# EAGLE design ALog-Shield (EAGLE 9.0.1)

## Sheet 1 of 2
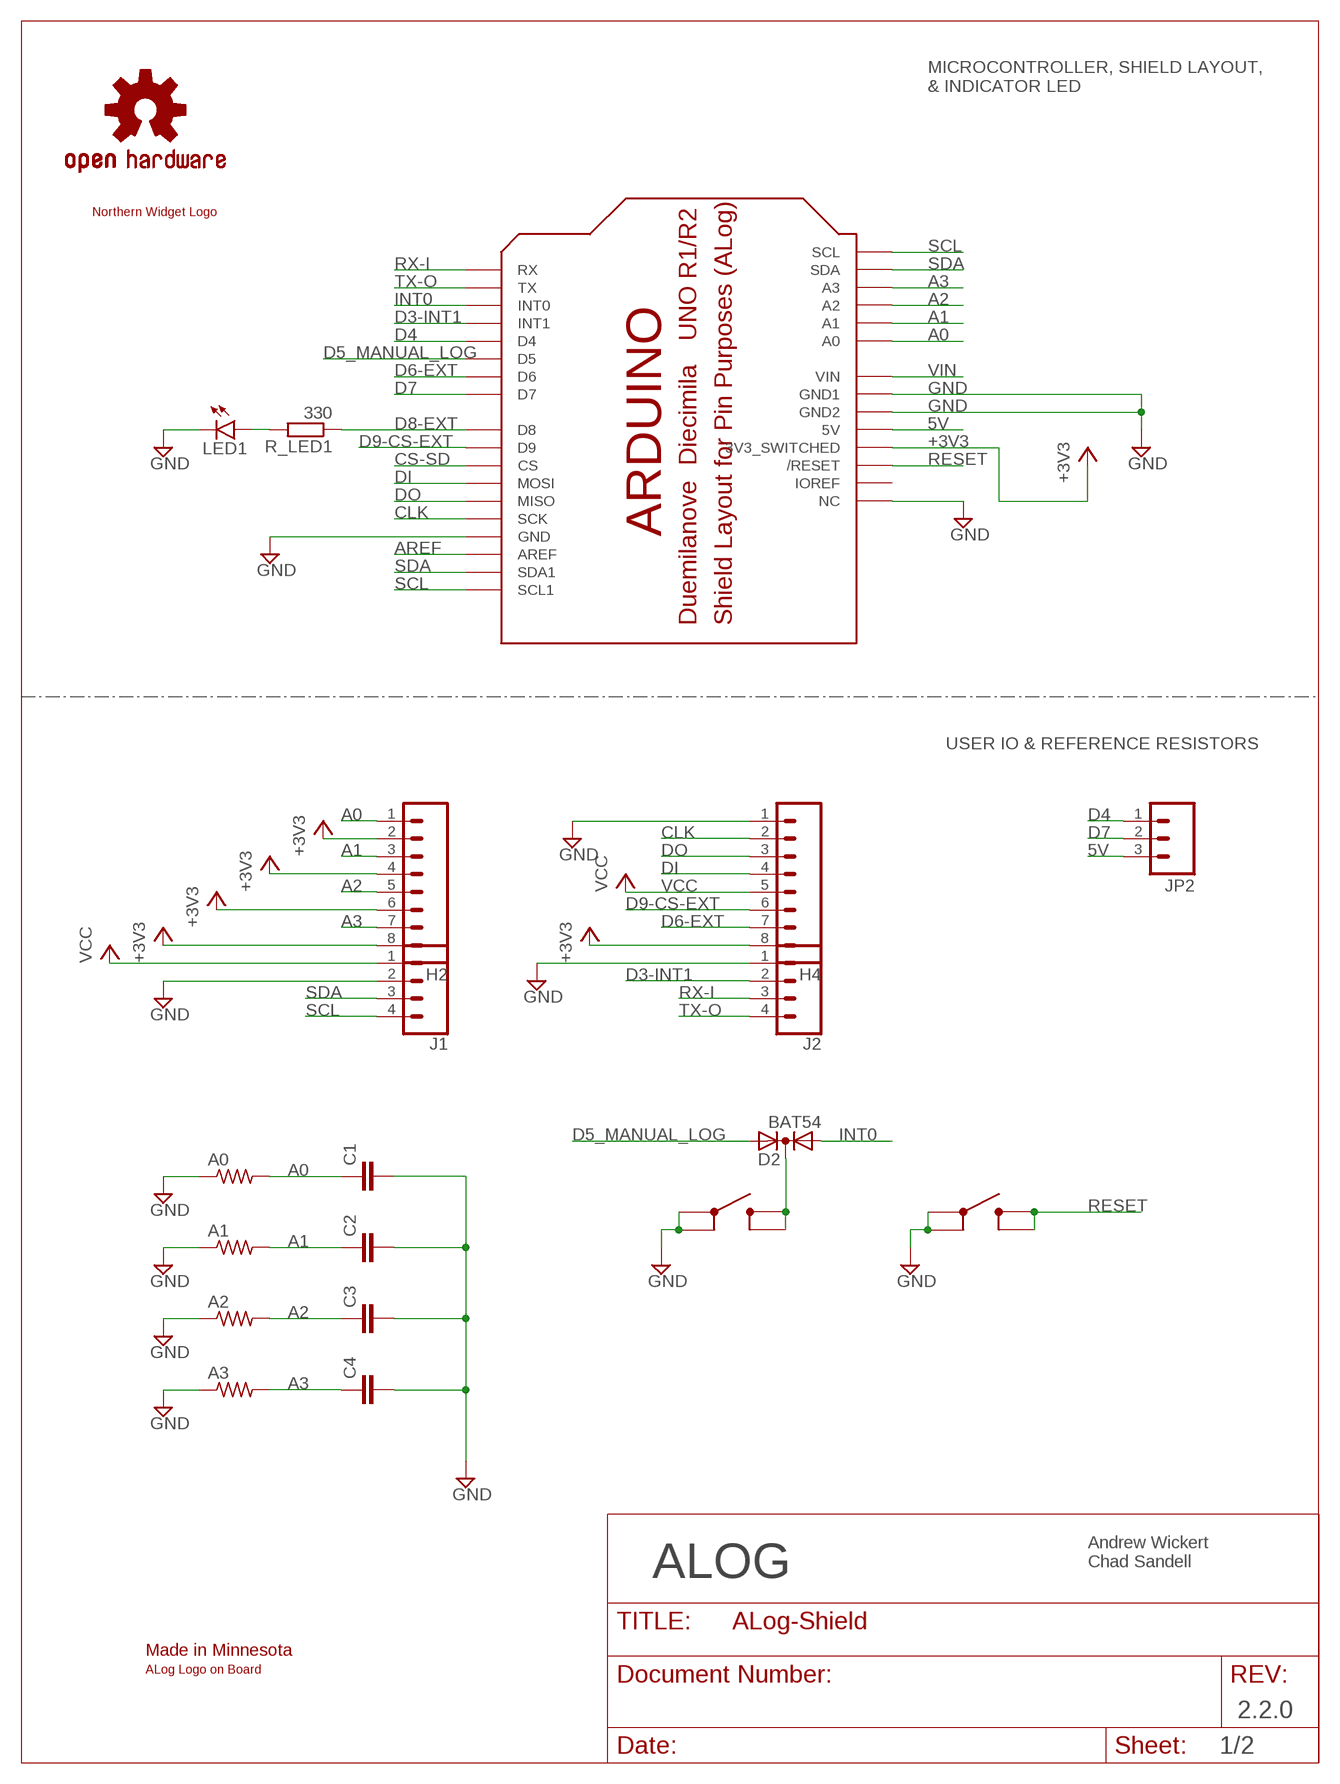
[diagram p0: schematic, sheet 1]

### Parts
A0  R-US_0207/10  [0207/10]
A1  R-US_0207/10  [0207/10]
A2  R-US_0207/10  [0207/10]
A3  R-US_0207/10  [0207/10]
C1  C-EU0.1UFC0603  [C0603]
C2  C-EU0.1UFC0603  [C0603]
C3  C-EU0.1UFC0603  [C0603]
C4  C-EU0.1UFC0603  [C0603]
D2  BAT54  DIODE_AC-CA_  [SOT23C]
H2  M083.5MM-8  [SCREWTERMINAL-3.5MM-8]
H4  M083.5MM-8  [SCREWTERMINAL-3.5MM-8]
J1  CONN_04SCREW  [SCREWTERMINAL-3.5MM-4]
J2  CONN_04SCREW  [SCREWTERMINAL-3.5MM-4]
JP2  M03SCREW  [SCREWTERMINAL-3.5MM-3]
LED1  LED1206  [LED-1206]
LOG  LOG  BUTTON4.2X3.2  [SWITCH_4.2X3.2]
LOGO1  OSHW-LOGOL  [OSHW-LOGO-L]
R_LED1  330  R-EU_330R0603  [R0603]
RESET  Reset  BUTTON4.2X3.2  [SWITCH_4.2X3.2]
U$1  NWLOGO_MED  [NWLOGO_MED]
U$2  MADE_IN_MN_220_SHIELD  [MADE_IN_MN_SHIELD_220]
U$3  ALOG_LOG  [ALOG_LOG]
U$9  AWICKERT_ARDUINO_SHIELD_PIN_PURPOSE  [AWICKERT_ARDUINO_SHIELD_PINS_ONLY]

### Nets
5V: JP2.3 U$9.5V
+3V3: H2.2 H2.4 H2.6 H2.8 H4.8 U$9.3.3V(3V3_SWITCHED) ; also sheet 2
A0: A0.2 C1.1 H2.1 U$9.A0
A1: A1.2 C2.1 H2.3 U$9.A1
A2: A2.2 C3.1 H2.5 U$9.A2
A3: A3.2 C4.1 H2.7 U$9.A3
AREF: U$9.AREF ; also sheet 2
CLK: H4.2 U$9.D13(SCK) ; also sheet 2
CS-SD: U$9.D10(CS) ; also sheet 2
D3-INT1: J2.2 U$9.D3(INT1)
D4: JP2.1 U$9.D4
D5_MANUAL_LOG: D2.2(A2) U$9.D5
D6-EXT: H4.7 U$9.D6
D7: JP2.2 U$9.D7
D8-EXT: R_LED1.1 U$9.D8
D9-CS-EXT: H4.6 U$9.D9
DI: H4.4 U$9.D11(MOSI) ; also sheet 2
DO: H4.3 U$9.D12(MISO) ; also sheet 2
GND: A0.1 A1.1 A2.1 A3.1 C1.2 C2.2 C3.2 C4.2 H4.1 J1.2 J2.1 LED1.C LOG.1 LOG.2 RESET.1 RESET.2 U$9.GND@0(GND) U$9.GND@1(GND1) U$9.GND@2(GND2) U$9.NC ; also sheet 2
INT0: D2.1(A1) U$9.D2(INT0) ; also sheet 2
LED+1: LED1.A R_LED1.2
N$1: D2.3(K) LOG.3 LOG.4
RESET: RESET.3 RESET.4 U$9.RES(/RESET)
RX-I: J2.3 U$9.RX
SCL: J1.4 U$9.A5(SCL) U$9.SCL(SCL1) ; also sheet 2
SDA: J1.3 U$9.A4(SDA) U$9.SDA(SDA1) ; also sheet 2
TX-O: J2.4 U$9.TX
VCC: H4.5 J1.1 ; also sheet 2
VIN: U$9.VIN
Unconnected: U$9.IOREF

### Notes on the sheet
- MICROCONTROLLER, SHIELD LAYOUT,
  & INDICATOR LED
- USER IO & REFERENCE RESISTORS
- Andrew Wickert
  Chad Sandell
- ALOG
- 2.2.0
- 1/2

## Sheet 2 of 2
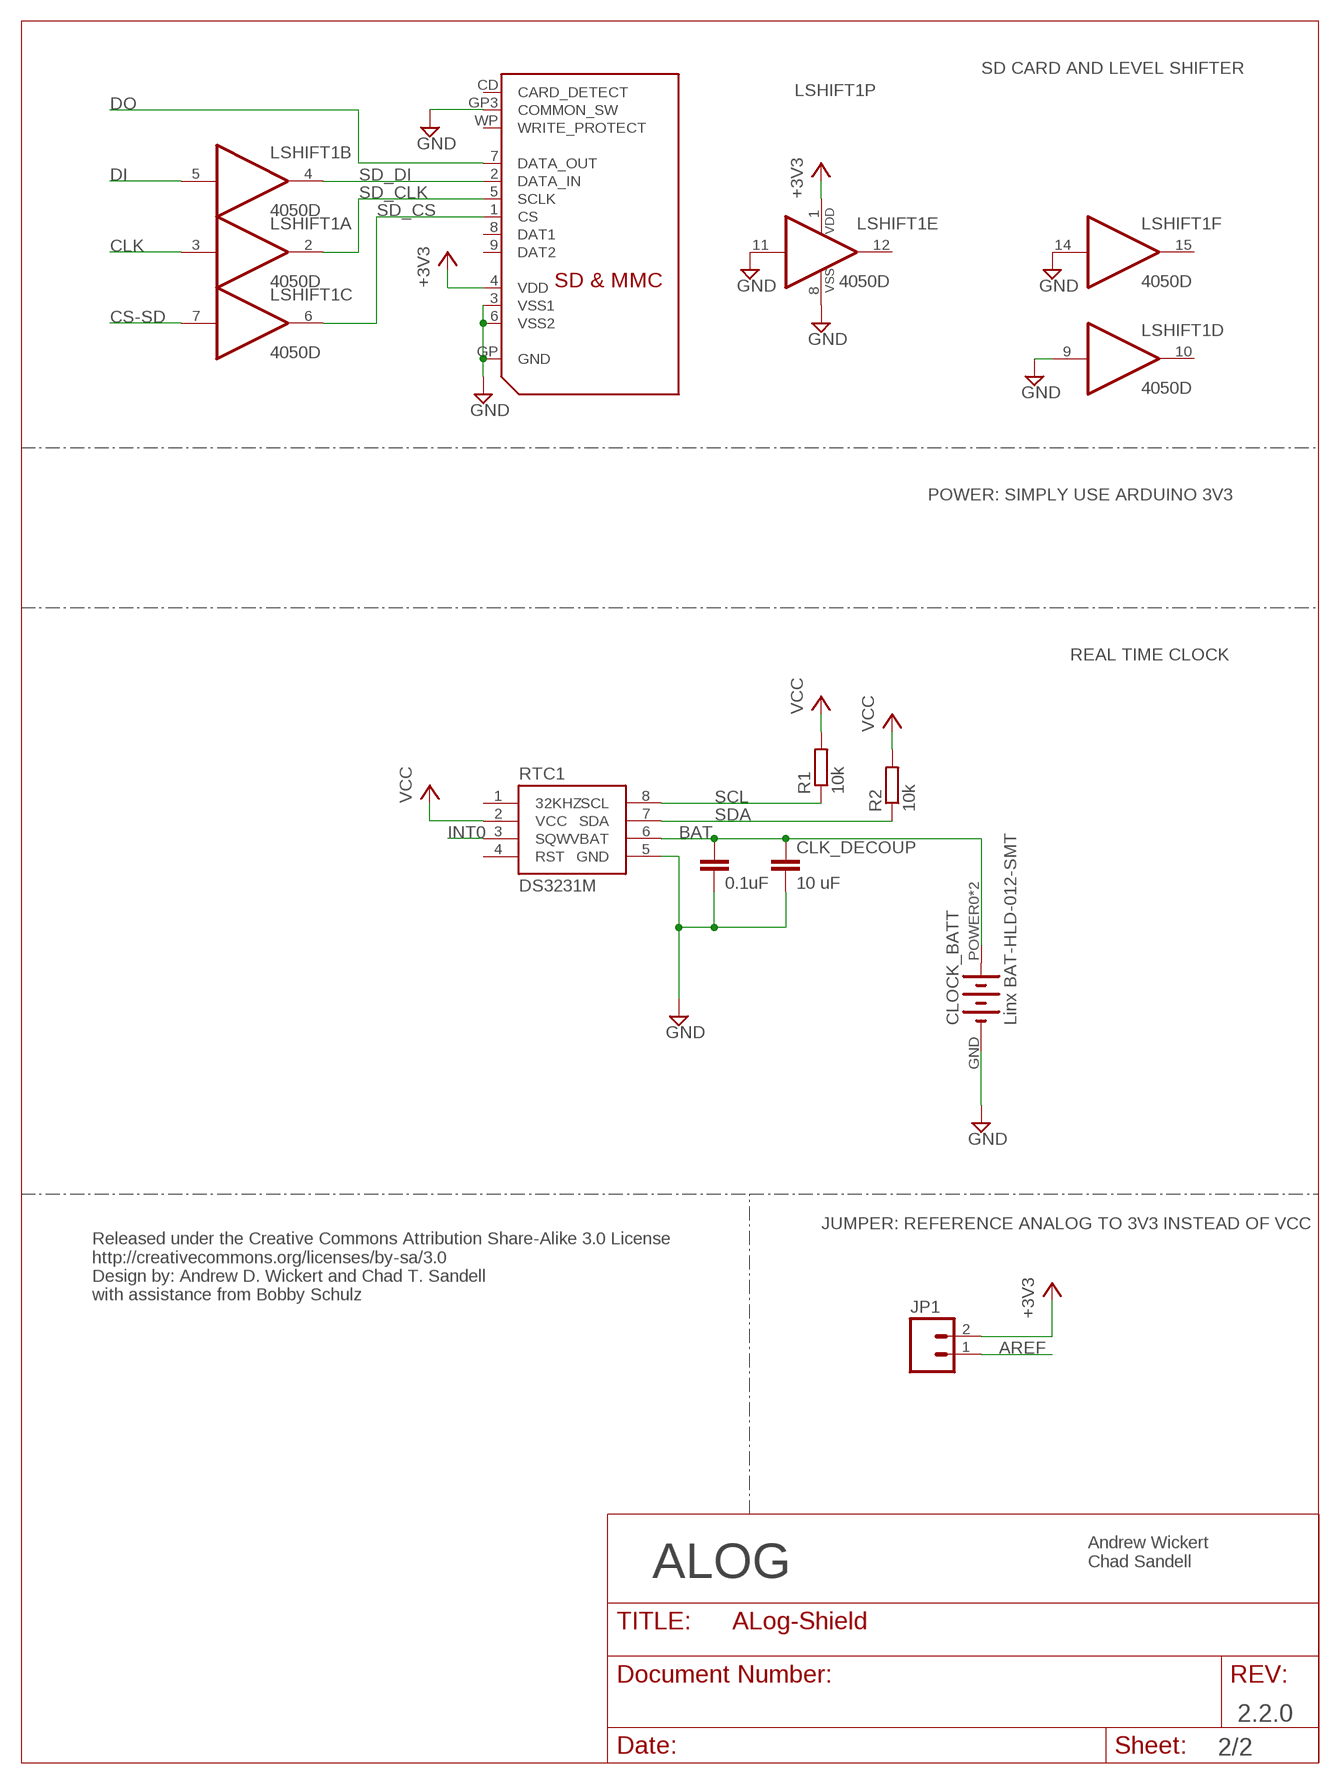
[diagram p1: schematic, sheet 2]

### Parts
CLK_DECOUP  10 uF  C-EU10UFC0805  [C0805]
CLOCK_BATT  Linx BAT-HLD-012-SMT  LINX-BAT-HLD-012-SMT-OTL  [LINX_BAT-HLD-012-SMT]
CLOCK_BATT_DECOUP  0.1uF  C-EU0.1UFC0603  [C0603]
JP1  M02LOCK  [1X02_LOCK]
LSHIFT1  4050D  [SO16]
R1  10k  R-EU_R0603  [R0603]
R2  10k  R-EU_R0603  [R0603]
RTC1  DS3231M  [SO08]
SD1  SDMMC06132  [06132]

### Nets
+3V3: JP1.2 LSHIFT1.1(P:VDD) SD1.4(VDD) ; also sheet 1
AREF: JP1.1 ; also sheet 1
BAT: CLK_DECOUP.1 CLOCK_BATT.POWER0(+) CLOCK_BATT.POWER1(+) CLOCK_BATT_DECOUP.1 RTC1.6(VBAT)
CLK: LSHIFT1.3(A:I) ; also sheet 1
CS-SD: LSHIFT1.7(C:I) ; also sheet 1
DI: LSHIFT1.5(B:I) ; also sheet 1
DO: SD1.7(DATA_OUT) ; also sheet 1
GND: CLK_DECOUP.2 CLOCK_BATT.GND(-) CLOCK_BATT_DECOUP.2 LSHIFT1.8(P:VSS) LSHIFT1.9(D:I) LSHIFT1.11(E:I) LSHIFT1.14(F:I) RTC1.5(GND) SD1.3(VSS1) SD1.6(VSS2) SD1.GP3(COMMON_SW) SD1.GP(GND) ; also sheet 1
INT0: RTC1.3(SQW) ; also sheet 1
SCL: R1.1 RTC1.8(SCL) ; also sheet 1
SD_CLK: LSHIFT1.2(A:O) SD1.5(SCLK)
SD_CS: LSHIFT1.6(C:O) SD1.1(CS)
SD_DI: LSHIFT1.4(B:O) SD1.2(DATA_IN)
SDA: R2.1 RTC1.7(SDA) ; also sheet 1
VCC: R1.2 R2.2 RTC1.2(VCC) ; also sheet 1
Unconnected: LSHIFT1.10(D:O) LSHIFT1.12(E:O) LSHIFT1.15(F:O) RTC1.1(32KHZ) RTC1.4(RST) SD1.8(DAT1) SD1.9(DAT2) SD1.CD(CARD_DETECT) SD1.WP(WRITE_PROTECT)

### Notes on the sheet
- SD CARD AND LEVEL SHIFTER
- POWER: SIMPLY USE ARDUINO 3V3
- REAL TIME CLOCK
- JUMPER: REFERENCE ANALOG TO 3V3 INSTEAD OF VCC
- Released under the Creative Commons Attribution Share-Alike 3.0 License
  http://creativecommons.org/licenses/by-sa/3.0
  Design by: Andrew D. Wickert and Chad T. Sandell
  with assistance from Bobby Schulz
- Andrew Wickert
  Chad Sandell
- ALOG
- 2.2.0
- 2/2

## Library data of the parts
A0 A1-A3 = resistor:R-US_: RESISTOR, American symbol
C1-C4 CLOCK_BATT_DECOUP = bschulz_passives:C-EU: CAPACITOR, European symbol; DIGIKEY: 1276-1005-1-ND; MF: Samsung; MPN: CL10B104KO8NNNC
CLK_DECOUP = bschulz_passives:C-EU: CAPACITOR, European symbol; DIGIKEY: 1276-2405-1-ND; MF: Samsung; MPN: CL21A106KQCLRNC
CLOCK_BATT = awickert:LINX-BAT-HLD-012-SMT-OTL
D2 = semicon-smd-ipc:DIODE_AC-CA_: DUAL DIODE
H2 H4 = SparkFun:M08: Header 8 Standard 8-pin 0.1" header. Use with straight break away headers (SKU : PRT-00116), right angle break away headers (PRT-00553), swiss pins (PRT-00743), machine pins (PRT-00117), and female headers (PRT-00115).
J1 J2 = SparkFun-Connectors:CONN_04: Multi connection point. Often used as Generic Header-pin footprint for 0.1 inch spaced/style header connections On any of the 0.1 inch spaced packages, you can populate with these: Break Away Headers - Straight <https://www.sparkfun.com/products/116> (PRT-00116) Break Away Male Headers - Right Angle <https://www.sparkfun.com/products/553> (PRT-00553) Female Headers <https://www.sparkfun.com/products/115> (PRT-00115) Break Away Headers - Machine Pin <https://www.sparkfun.com/products/117> (PRT-00117) Break Away Female Headers - Swiss Machine Pin <https://www.sparkfun.com/products/743> (PRT-00743) For SCREWTERMINALS and SPRING TERMINALS visit here: Screw Terimnals on SparkFun.com <https://www.sparkfun.com/search/results?term=Screw+Terminals> (5mm/3.5mm/2.54mm spacing) This device is also useful as a general connection point to wire up your design to another part of your project. Our various solder wires solder well into these plated through hole pads. Hook-Up Wire - Assortment (Stranded, 22 AWG) <https://www.sparkfun.com/products/11375> (PRT-11375) Hook-Up Wire - Assortment (Solid Core, 22 AWG) <https://www.sparkfun.com/products/11367> (PRT-11367) View the entire wire category on our website here <https://www.sparkfun.com/categories/141> Special notes: Molex polarized connector foot print use with SKU : PRT-08231 with associated crimp pins and housings. 1MM SMD Version SKU: PRT-10208; PROD_ID: 2xCONN-08399; SF_ID: 2xPRT-08084
JP1 = SparkFun-Connectors:M02: Standard 2-pin 0.1" header. Use with - straight break away headers ( PRT-00116) - right angle break away headers (PRT-00553) - swiss pins (PRT-00743) - machine pins (PRT-00117) - female headers (PRT-00115) Molex polarized connector foot print use with: PRT-08233 with associated crimp pins and housings. 2.54_SCREWTERM for use with PRT-10571. 3.5mm Screw Terminal footprints for PRT-08084 5mm Screw Terminal footprints for use with PRT-08432
JP2 = SparkFun-Connectors:M03: Header 3 Standard 3-pin 0.1" header. Use with straight break away headers (SKU : PRT-00116), right angle break away headers (PRT-00553), swiss pins (PRT-00743), machine pins (PRT-00117), and female headers (PRT-00115). Molex polarized connector foot print use with SKU : PRT-08232 with associated crimp pins and housings.; PROD_ID: CONN-08288
LED1 = SparkFun-LED:LED: LEDs Standard schematic elements and footprints for 5mm, 3mm, 1206, and 0603 sized LEDs. 5mm - Spark Fun Electronics SKU : COM-00529 (and others)
LOG RESET = bschulz:BUTTON: Genaric SPST Pushbutton
LOGO1 = SparkFun-Aesthetics:OSHW-LOGO: Open Source Hardware Logo This logo indicates the piece of hardware it is found on incorporates a OSHW license and/or adheres to the definition of open source hardware found here: http://freedomdefined.org/OSHW
LSHIFT1 = 40xx:4050: Hex non-inverting BUFFER
R1 R2 = bschulz:R-EU_: RESISTOR, European symbol
R_LED1 = bschulz_passives:R-EU_: RESISTOR, European symbol; DIGIKEY: 311-330HRCT-ND; MF: Yageo; MPN: RC0603FR-07330RL; VALUE_PART: 330
RTC1 = bschulz:DS3231M: DS3231M Real Time Clock Accuracy +/-5ppm. Battery Backup. 2.3V to 5.5V. Datasheet <https://cdn.sparkfun.com/datasheets/Dev/Beagle/DS3231M.pdf> SparkFun Products CryptoCape <https://www.sparkfun.com/products/12773> (DEV-12773) SparkFun CryptoShield <https://www.sparkfun.com/products/13183> (DEV-13183); DIGIKEY: DS3231MZ+-ND; MF: Maxim; MPN: DS3231MZ+
SD1 = adafruit:SDMMC: SD MMC Card holder 4UCON part #06132 - easy to solder
U$1 = awickert:NWLOGO_MED: Medium-sized Northern Widget logo
U$2 = awickert:MADE_IN_MN_220_SHIELD
U$3 = awickert:ALOG_LOG
U$9 = ALog-Shield:AWICKERT_ARDUINO_SHIELD_PIN_PURPOSE

## Net classes
0 default: width 0.203 mm, drill 0.305 mm
1 power: width 0.254 mm

## Board
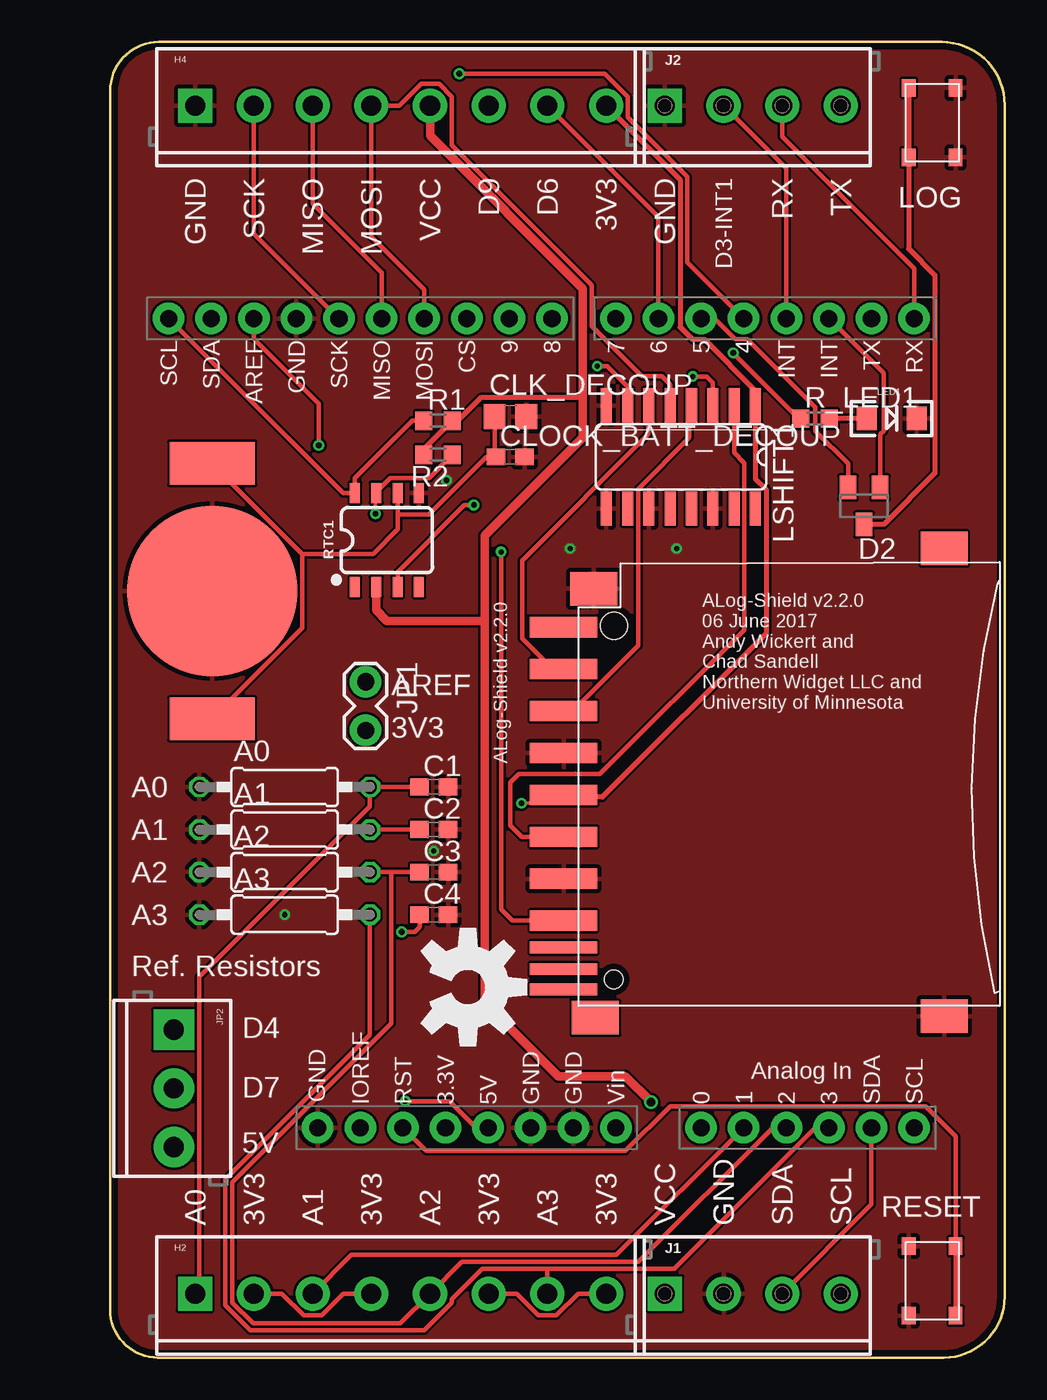
[diagram p2: board, top side]
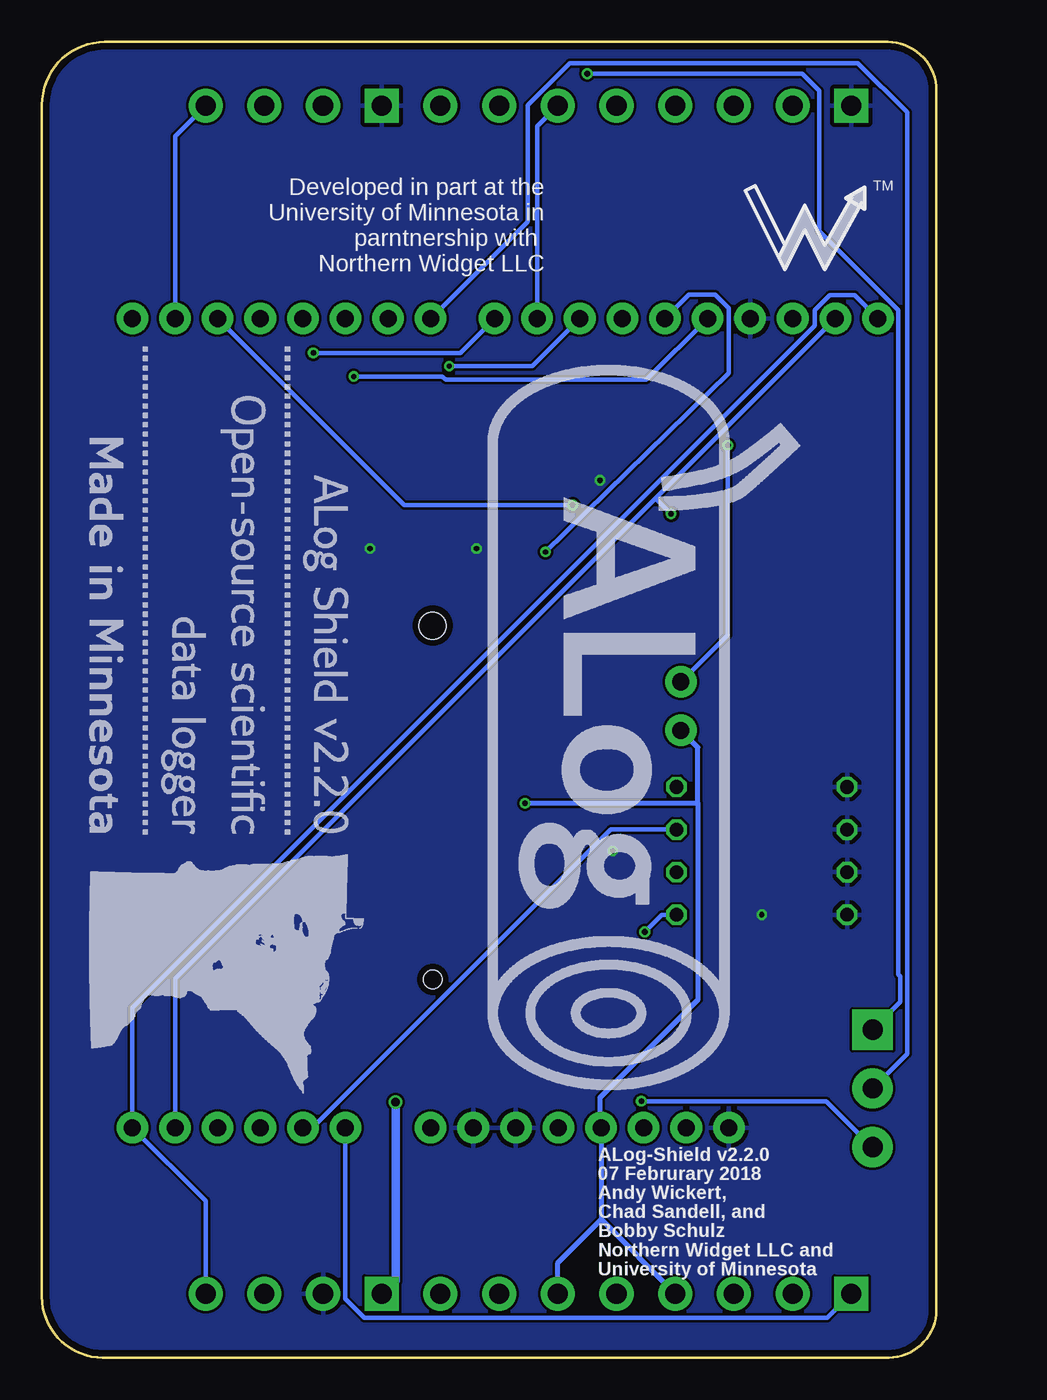
[diagram p3: board, bottom side, seen from below]

Size 53.33 x 78.47 mm. Coordinates in mm from the lower left corner, seen from the top.
Outline: 53.33,74.72 arc90 49.57,78.47 2.91,78.47 arc90 0,75.56 0,2.85 arc90 2.85,0 49.71,0 arc90 53.33,3.62 53.33,74.72
Copper layers (1*16): Top 0.035559375mm / dielectric 1.6mm / Bottom 0.035559375mm
Design rules "oshpark-2layer *": minimum track width 6mil, minimum drill 10mil, track to track 6mil, track to pad 6mil, pad to pad 6mil, via to via 6mil, smd to smd 6mil, copper to edge 15mil, drill to drill 6mil, minimum pad ring 6mil, minimum via ring 6mil, stop-mask expansion 2.5mil, vias tented up to drill 0mil, thermal gap 10mil

### Footprints (pad centres in the part's own frame; a part is rotated, then mirrored left to right if it is on the bottom)
0207/10 = drill 0.813 octagon: 1 -5.08,0; 2 5.08,0
C0603 = smd 1.1 x 1: 1 -0.85,0; 2 0.85,0
C0805 = smd 1.3 x 1.5: 1 -0.95,0; 2 0.95,0
LINX_BAT-HLD-012-SMT = smd 10.16 x 10.16: GND 0,0 | smd 2.54 x 5.08: POWER0 -7.62,0; POWER1 7.62,0
SOT23C = smd 1 x 1.4: 1 -0.95,-1.1; 2 0.95,-1.1; 3 0,1.1
SCREWTERMINAL-3.5MM-8 = drill 1.2 pad 2.032 square: 1 0,0 | drill 1.2 pad 2.032: 2 3.5,0; 3 7,0; 4 10.5,0; 5 14,0; 6 17.5,0; 7 21,0; 8 24.5,0
SCREWTERMINAL-3.5MM-4 = drill 1.2 pad 2.032 square: 1 0,0 | drill 1.2 pad 2.032: 2 3.5,0; 3 7,0; 4 10.5,0
1X02_LOCK = drill 1.016 pad 1.88: 1 -0.178,0; 2 2.718,0
SCREWTERMINAL-3.5MM-3 = drill 1.2 pad 2.413 square: 1 0,0 | drill 1.2 pad 2.413: 2 3.5,0; 3 7,0
LED-1206 = smd 1.2 x 1.4: A -1.5,0; C 1.5,0
SWITCH_4.2X3.2 = smd 1.05 x 0.812: 1 -2.075,1.4; 2 2.075,1.4; 3 -2.075,-1.4; 4 2.075,-1.4
SO16 = smd 0.66 x 2.032: 1 -4.445,-3.073; 2 -3.175,-3.073; 3 -1.905,-3.073; 4 -0.635,-3.073; 5 0.635,-3.073; 6 1.905,-3.073; 7 3.175,-3.073; 8 4.445,-3.073; 9 4.445,3.073; 10 3.175,3.073; 11 1.905,3.073; 12 0.635,3.073; 13 -0.635,3.073; 14 -1.905,3.073; 15 -3.175,3.073; 16 -4.445,3.073
R0603 = smd 1 x 1.1: 1 -0.85,0; 2 0.85,0
SO08 = smd 0.6 x 1.2: 1 -1.905,-2.8; 2 -0.635,-2.8; 3 0.635,-2.8; 4 1.905,-2.8; 5 1.905,2.8; 6 0.635,2.8; 7 -0.635,2.8; 8 -1.905,2.8
06132 = smd 1.2 x 4: 1 6.9,0.9; 2 4.4,0.9; 3 1.9,0.9; 4 -0.6,0.9; 5 -3.1,0.9; 6 -5.6,0.9; 7 -8.1,0.9; 9 9.4,0.9 | smd 0.7 x 4: 8 -9.7,0.9; CD -11,0.9; WP -12.2,0.9 | smd 2 x 2.8: GP -13.8,-21.8; GP2 14.1,-21.8; GP3 11.7,-0.9; GP4 -13.9,-1 | hole 1.1: -11.6,-2.1 | hole 1.6: 9.5,-2.1
AWICKERT_ARDUINO_SHIELD_PINS_ONLY = drill 1.016 pad 1.88: 3.3V 50.8,26.67; 5V 50.8,29.21; A0 50.8,41.91; A1 50.8,44.45; A2 50.8,46.99; A3 50.8,49.53; A4 50.8,52.07; A5 50.8,54.61; AREF 2.54,15.24; D2 2.54,49.53; D3 2.54,46.99; D4 2.54,44.45; D5 2.54,41.91; D6 2.54,39.37; D7 2.54,36.83; D8 2.54,33.02; D9 2.54,30.48; D10 2.54,27.94; D11 2.54,25.4; D12 2.54,22.86; D13 2.54,20.32; GND@0 50.8,31.75; GND@1 50.8,34.29; GND@2 2.54,17.78; IOREF 50.8,21.59; NC 50.8,19.05; RES 50.8,24.13; RX 2.54,54.61; SCL 2.54,10.16; SDA 2.54,12.7; TX 2.54,52.07; VIN 50.8,36.83

### Placement (x,y rotation side)
A0  10.4,34.04 0 top
A1  10.4,31.5 0 top
A2  10.4,28.96 0 top
A3  10.4,26.42 0 top
C1  19.29,34.04 0 top
C2  19.29,31.5 0 top
C3  19.29,28.96 0 top
C4  19.29,26.42 0 top
CLK_DECOUP  23.87,56.13 0 top
CLOCK_BATT  6.09,45.72 90 top
CLOCK_BATT_DECOUP  23.87,53.72 0 top
D2  44.95,50.8 180 top
H2  5.07,3.81 0 top
H4  5.07,74.68 0 top
J1  33.07,3.81 0 top
J2  33.07,74.68 0 top
JP1  15.23,40.13 270 top
JP2  3.8,19.56 270 top
LED1  46.6,56.01 0 top
LOG  49.01,73.66 270 top
LOGO1  21.33,22.1 270 top
LSHIFT1  34.03,53.72 180 top
R1  19.55,55.88 0 top
R2  19.55,53.85 180 top
R_LED1  42.03,56.01 0 top
RESET  49.01,4.57 90 top
RTC1  16.5,48.77 0 top
SD1  27.93,34.16 90 top
U$1  7.86,67.82 0 bottom
U$2  42.92,30.48 90 top
U$3  19.55,35.05 90 top
U$9  -6.68,64.52 270 top

### Tracks (layer width: path | path; a pad name or v marks a point on that pad's centre or on a via)
5V  (via drill 0.33)
  Top 0.254: v17.59,15.29 20.26,15.29 21.83,13.72 U$9.5V
  Bottom 0.203: 3.9,12.62 JP2.3
  Bottom 0.254: v17.59,15.29 6.57,15.29 3.9,12.62
+3V3  (via drill 0.33)
  Top 0.203: 38.4,57.51 38.4,56.9 LSHIFT1.1 | 27.83,33.73 27.22,33.73 SD1.4 27.02,33.43 26.66,33.07 v24.53,33.07
  Top 0.254: H2.4 13.9,3.81 12.61,2.52 11.53,2.52 10.24,3.81 H2.2 | H2.8 27.9,3.81 26.61,2.52 25.53,2.52 24.24,3.81 H2.6
  Top 0.305: H4.8 33.99,70.26 33.99,61.46 34.72,60.73 35.42,60.73 38.47,57.68 LSHIFT1.1 38.47,52.42 39.11,51.79 39.11,43.18 29.35,33.43 27.02,33.43
  Bottom 0.203: 22.54,3.86 H2.6
  Bottom 0.305: v24.53,33.07 14.21,33.07 | JP1.2 14.21,36.4 14.21,33.07 | 14.21,33.07 14.21,21.34 20.06,15.49 20.06,13.78 U$9.3.3V 19.99,8.23 | 19.99,8.23 H2.4 | H2.6 22.57,5.66 19.99,8.23
A0
  Top 0.203: 18.3,34.14 C1.1
  Top 0.254: C1.1 A0.2 15.48,32.87 5.32,22.71 5.32,4.06 H2.1
  Bottom 0.254: U$9.A0 35.23,3.49 34.12,2.38 6.5,2.38 H2.1
A1
  Top 0.203: 18.3,31.47 C2.1
  Top 0.254: H2.3 14.38,6.12 30.18,6.12 U$9.A1 | C2.1 A1.2
  Bottom 0.254: A1.2 19.42,31.5 37.2,13.72 U$9.A1
A2
  Top 0.203: 18.3,28.8 C3.1
  Top 0.254: U$9.A2 39.5,13.72 31.5,5.71 20.97,5.71 H2.5 17.29,2.03 8.52,2.03 7.28,3.27 7.28,10.46 16.75,19.94 16.75,28.96 | 16.75,28.96 A2.2 | 16.75,28.96 C3.1
A3  (via drill 0.35)
  Top 0.254: U$9.A3 42.04,13.72 33.63,5.31 26.07,5.31 | 26.07,5.31 H2.7 | 26.07,5.31 22.19,5.31 20.36,3.48 20.36,3.27 18.72,1.63 8.35,1.63 6.87,3.1 6.87,10.63 15.48,19.24 A3.2 | v17.39,25.4 18.15,25.4 18.44,25.69 C4.1
  Bottom 0.254: A3.2 16.37,26.42 v17.39,25.4
AREF  (via drill 0.33)
  Top 0.254: v12.44,54.41 12.44,56.9 8.56,60.77 U$9.AREF
  Bottom 0.254: JP1.1 12.44,43.1 v12.44,54.41
BAT
  Top 0.203: 6.21,53.34 CLOCK_BATT.POWER1 | 22.93,56.01 CLK_DECOUP.1 | 22.93,53.7 CLOCK_BATT_DECOUP.1
  Top 0.254: 11.45,47.94 11.45,43.5 6.09,38.14 CLOCK_BATT.POWER0 | CLOCK_BATT.POWER1 6.09,53.3 11.45,47.94 | RTC1.6 17.13,50.29 | 17.13,50.29 17.13,49.4 15.67,47.94 11.45,47.94 | 17.13,50.29 18.99,50.29 22.42,53.72 CLOCK_BATT_DECOUP.1 | CLK_DECOUP.1 22.92,53.71 22.93,53.7
CLK  (via drill 0.3)
  Top 0.254: H4.2 8.57,67.05 U$9.D13 | v34.74,58.52 35.58,58.52 35.93,58.17 LSHIFT1.3
  Bottom 0.254: v34.74,58.52 29.45,58.52 29.25,58.32 17.3,58.32 U$9.D13
CS-SD  (via drill 0.3)
  Top 0.254: LSHIFT1.7 30.85,57.91 29.63,59.13 v29.05,59.13
  Bottom 0.254: U$9.D10 24.11,59.13 v29.05,59.13
D3-INT1
  Top 0.254: J2.2 40.31,70.93 U$9.D3
D4  (via drill 0.35)
  Top 0.254: U$9.D4 34.42,65.33 34.42,70.44 30.86,73.99 30.86,75.21 29.5,76.58 v20.82,76.58
  Bottom 0.254: JP2.1 2.15,21.21 2.15,22.73 2.26,22.85 2.26,62.48 6.98,67.19 6.98,75.56 7.99,76.58 v20.82,76.58
D5_MANUAL_LOG
  Top 0.254: U$9.D5 36.05,61.98 37.27,60.76 37.99,60.76 42.05,56.69 42.05,55.27 44,53.33 D2.2
D6-EXT
  Top 0.254: H4.7 32.69,68.05 U$9.D6
D7
  Bottom 0.254: JP2.2 1.74,18.11 1.74,74.27 4.69,77.22 21.86,77.22 24.37,74.7 24.37,67.75 U$9.D7
D8-EXT  (via drill 0.33)
  Top 0.254: v37.15,59.92 41.06,56.01 R_LED1.1
  Bottom 0.254: U$9.D8 28.4,59.92 v37.15,59.92
D9-CS-EXT
  Bottom 0.254: U$9.D9 23.8,73.44 H4.6
DI
  Top 0.203: 33.32,56.9 LSHIFT1.5
  Top 0.254: U$9.D11 18.72,63.69 15.57,66.84 H4.4 17.24,74.68 18.53,75.97 19.61,75.97 20.36,75.21 20.36,72.33 28.72,63.98 28.72,61.53 31.7,58.55 32.88,58.55 33.39,58.04 LSHIFT1.5
DO  (via drill 0.3)
  Top 0.203: 26.2,26.21 27.02,26.21 SD1.7
  Top 0.254: v23.31,48.06 23.31,26.72 23.96,26.06 SD1.7 | U$9.D12 16.18,64.71 12.07,68.82 H4.3
  Bottom 0.254: v23.31,48.06 12.38,58.73 12.38,62.59 13.2,63.4 14.76,63.4 U$9.D12
GND  (via drill 0.3)
  other vias: 27.42,48.26 10.4,26.42 33.77,48.26 19.29,30.23 20.06,52.32
  pour Bottom (isolate 0.152): -1.28,78.74 -1.28,-1.27 54.6,-1.27 54.6,78.74
  pour Top (isolate 0.152): -1.28,78.74 -1.28,-1.27 54.6,-1.27 54.6,78.74
INT0  (via drill 0.33)
  Top 0.203: 45.91,52.02 D2.1 | 42.87,61.98 U$9.D2
  Top 0.254: 45.91,52.02 45.91,55.07 46.12,55.27 46.12,58.73 42.87,61.98 | RTC1.3 17.13,46.86 21.12,50.85 v21.68,50.85
  Bottom 0.203: 42.66,61.98 U$9.D2
  Bottom 0.254: v21.68,50.85 31.73,50.85 U$9.D2
LED+1
  Top 0.305: LED1.A R_LED1.2
N$1
  Top 0.305: LOG.3 LOG.4 47.61,66.14 49.18,64.57 49.18,52.74 46.13,49.7 D2.3
RESET
  Top 0.254: U$9.RES 18.85,12.32 30.72,12.32 33.39,14.99 48.63,14.99 50.41,13.21 RESET.4 RESET.3
RX-I
  Top 0.254: J2.3 40.07,72.82 47.93,64.96 U$9.RX
SCL
  Top 0.254: U$9.SCL 13.89,51.57 RTC1.8 14.6,52.45 18.02,55.88 R1.1
  Bottom 0.254: U$9.SCL 4.88,63.37 6.35,63.37 7.24,62.48 7.24,61.56 47.93,20.87 U$9.A5 43.57,9.35 J1.4
SD_CLK
  Top 0.203: 27.62,31.09 27.22,31.09 SD1.5 | 37.38,56.69 LSHIFT1.2
  Top 0.254: SD1.5 24.55,31.06 23.87,31.75 23.87,34.29 24.37,34.8 29.2,34.8 37.81,43.41 37.81,53.37 37.2,53.98 LSHIFT1.2
SD_CS
  Top 0.203: 32.1,56.69 LSHIFT1.6 | 27.02,41.25 SD1.1
  Top 0.254: 32.1,56.69 32.1,55.07 24.58,47.55 24.58,42.88 26.2,41.25 27.02,41.25
SD_DI
  Top 0.203: 34.53,56.69 LSHIFT1.4 | 27.22,38.61 SD1.2
  Top 0.254: 34.53,56.69 34.53,54.86 31.49,51.82 31.49,42.47 27.62,38.61 27.22,38.61
SDA  (via drill 0.33)
  Top 0.203: v15.81,50.32 15.81,51.56 RTC1.7 15.99,51.74 | 20.26,53.7 R2.1
  Top 0.254: 20.26,53.7 19.01,52.45 16.7,52.45 15.99,51.74 | U$9.A4 45.39,9.13 J1.3
  Bottom 0.254: U$9.A4 45.39,22.61 16.72,51.28 | 16.72,51.28 U$9.SDA | v15.81,50.32 16.72,51.23 16.72,51.28
TX-O
  Bottom 0.254: J2.4 45.39,72.85 U$9.TX
VCC  (via drill 0.51)
  Top 0.203: 15.99,45.87 RTC1.2
  Top 0.305: 28.18,57.25 22.09,57.25 20.72,55.88 R1.2 18.7,54.18 R2.2
  Top 0.508: H4.5 19.07,72.87 28.18,63.75 28.18,57.25 28.18,54.86 22.34,49.02 22.34,43.94 | 22.34,43.94 16.5,43.94 15.87,44.58 RTC1.2 | 22.34,43.94 22.34,21.14 26.72,16.76 30.72,16.76 v32.25,15.24
  Bottom 0.508: v32.25,15.24 32.25,4.57 33.01,3.81 J1.1

### Text on the board
tPlace: GND | SCK | MISO | MOSI | VCC | D9 | D6 | 3V3 | GND | D3-INT1 | RX | TX | AREF | ALog-Shield v2.2.0 / 06 June 2017 / Andy Wickert and / Chad Sandell / Northern Widget LLC and / University of Minnesota | 3V3 | ALog-Shield v2.2.0 | A0 | A1 | A2 | A3 | Ref. Resistors | D4 | D7 | GND | 5V | A0 | 3V3 | A1 | 3V3 | A2 | 3V3 | A3 | 3V3 | VCC | GND | SDA | SCL
bPlace: TM | Developed in part at the / University of Minnesota in / parntnership with / Northern Widget LLC | ALog-Shield v2.2.0 / 07 Februrary 2018 / Andy Wickert, / Chad Sandell, and / Bobby Schulz / Northern Widget LLC and / University of Minnesota